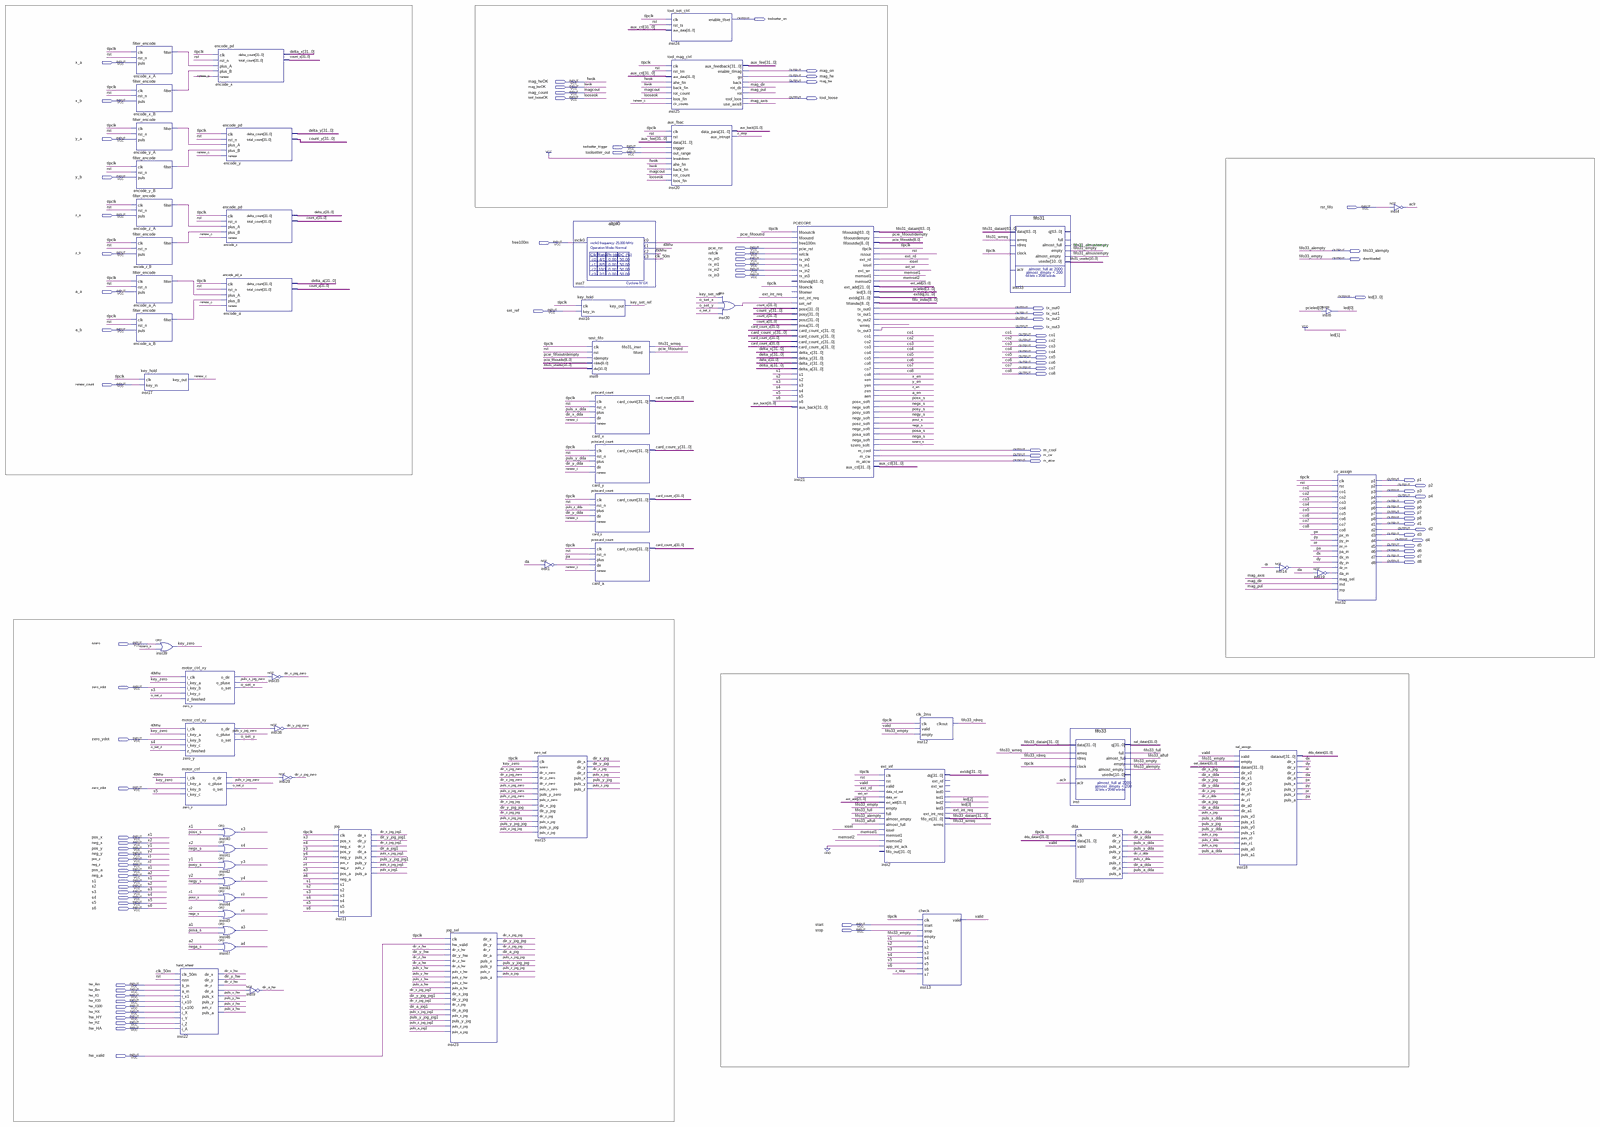
[diagram p0: schematic sheet, whole]
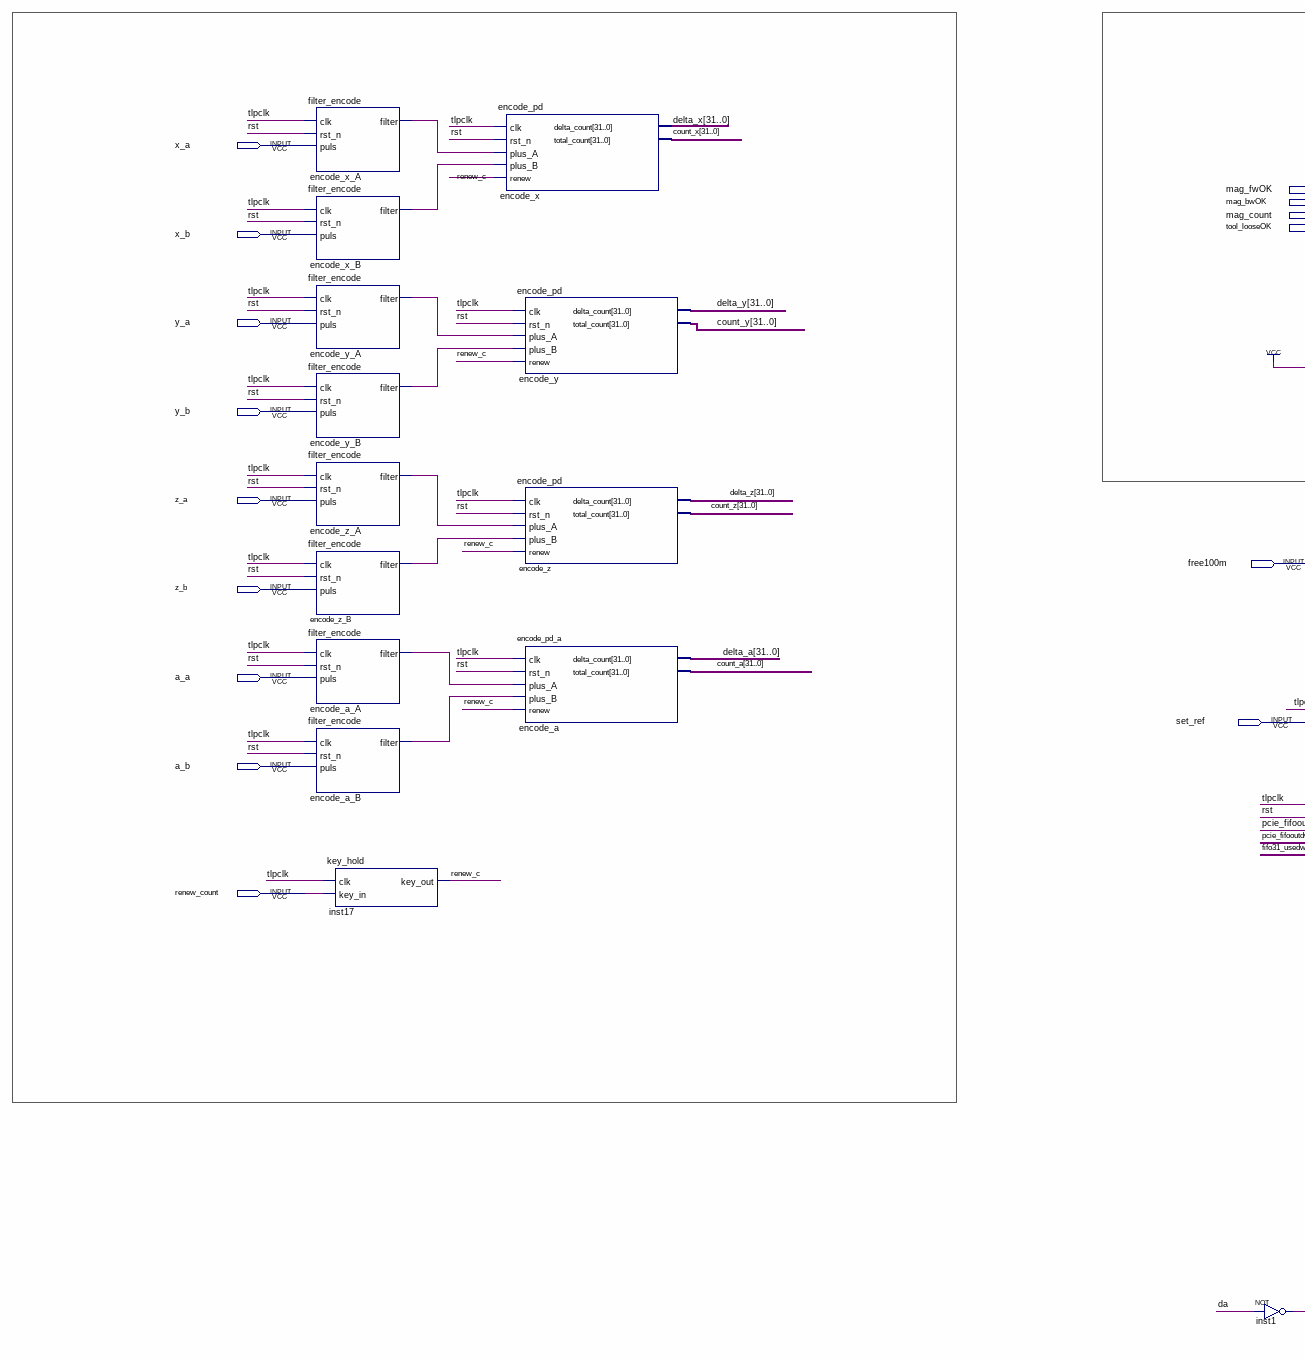
[diagram p1: schematic sheet, upper left part]
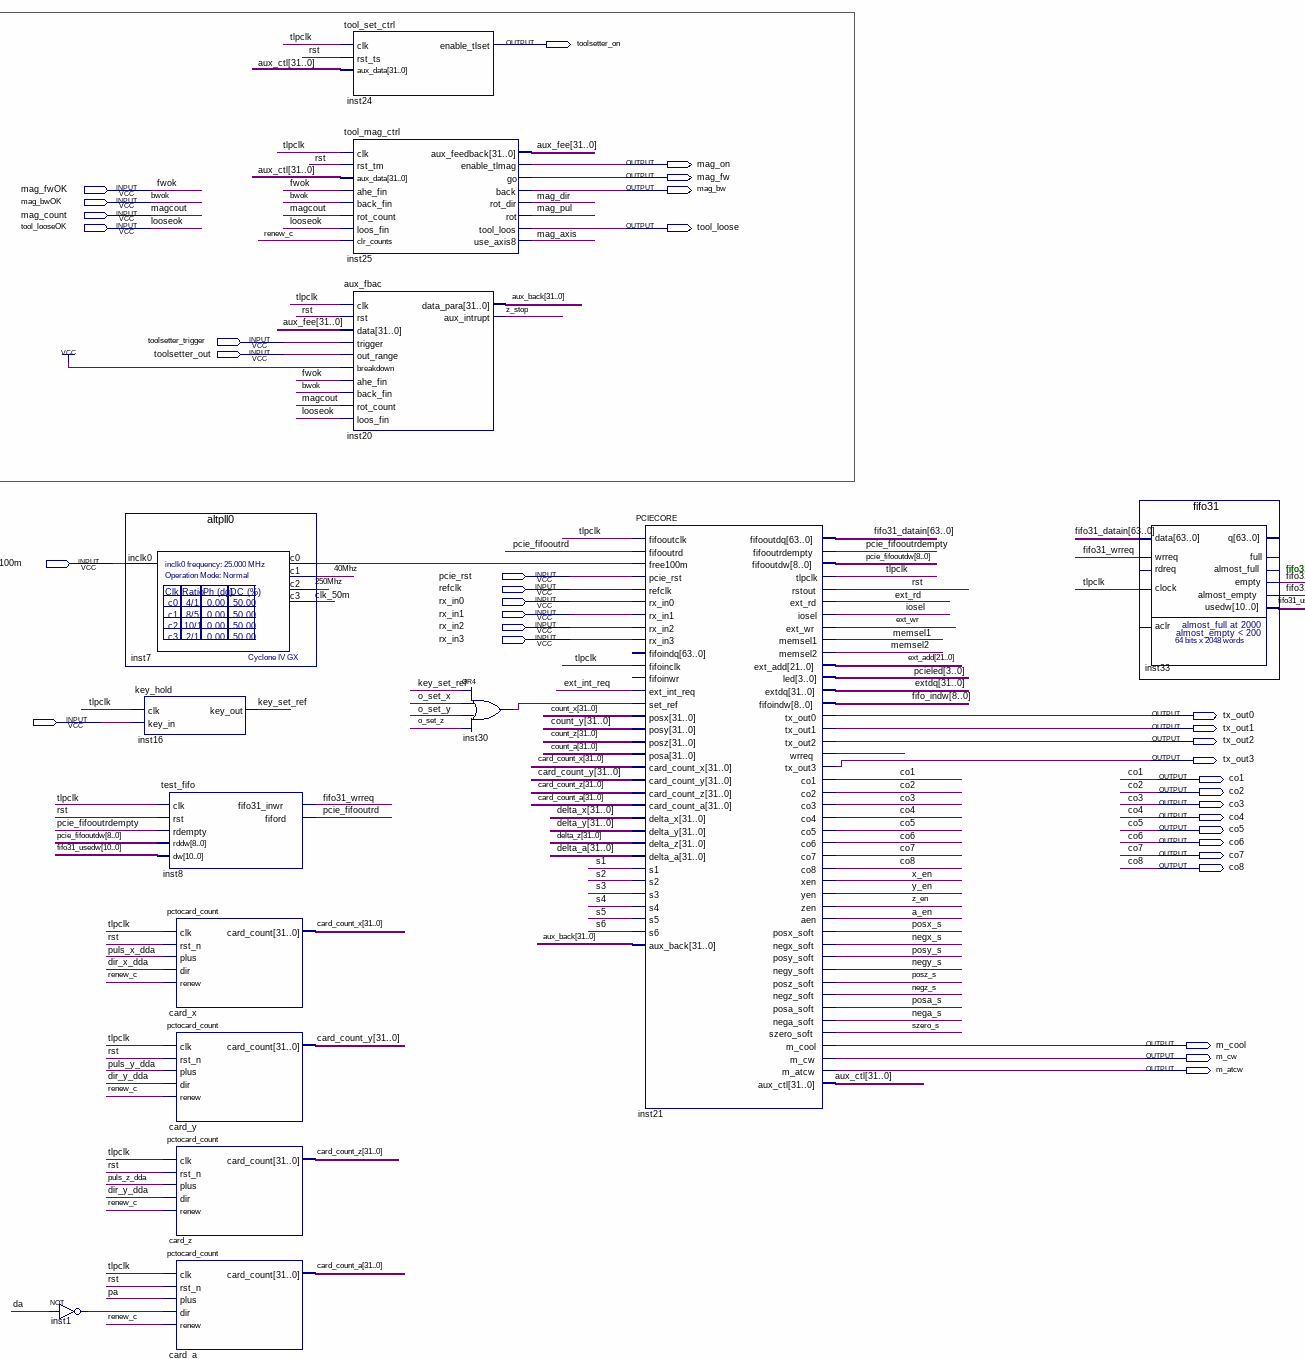
[diagram p2: schematic sheet, upper centre part]
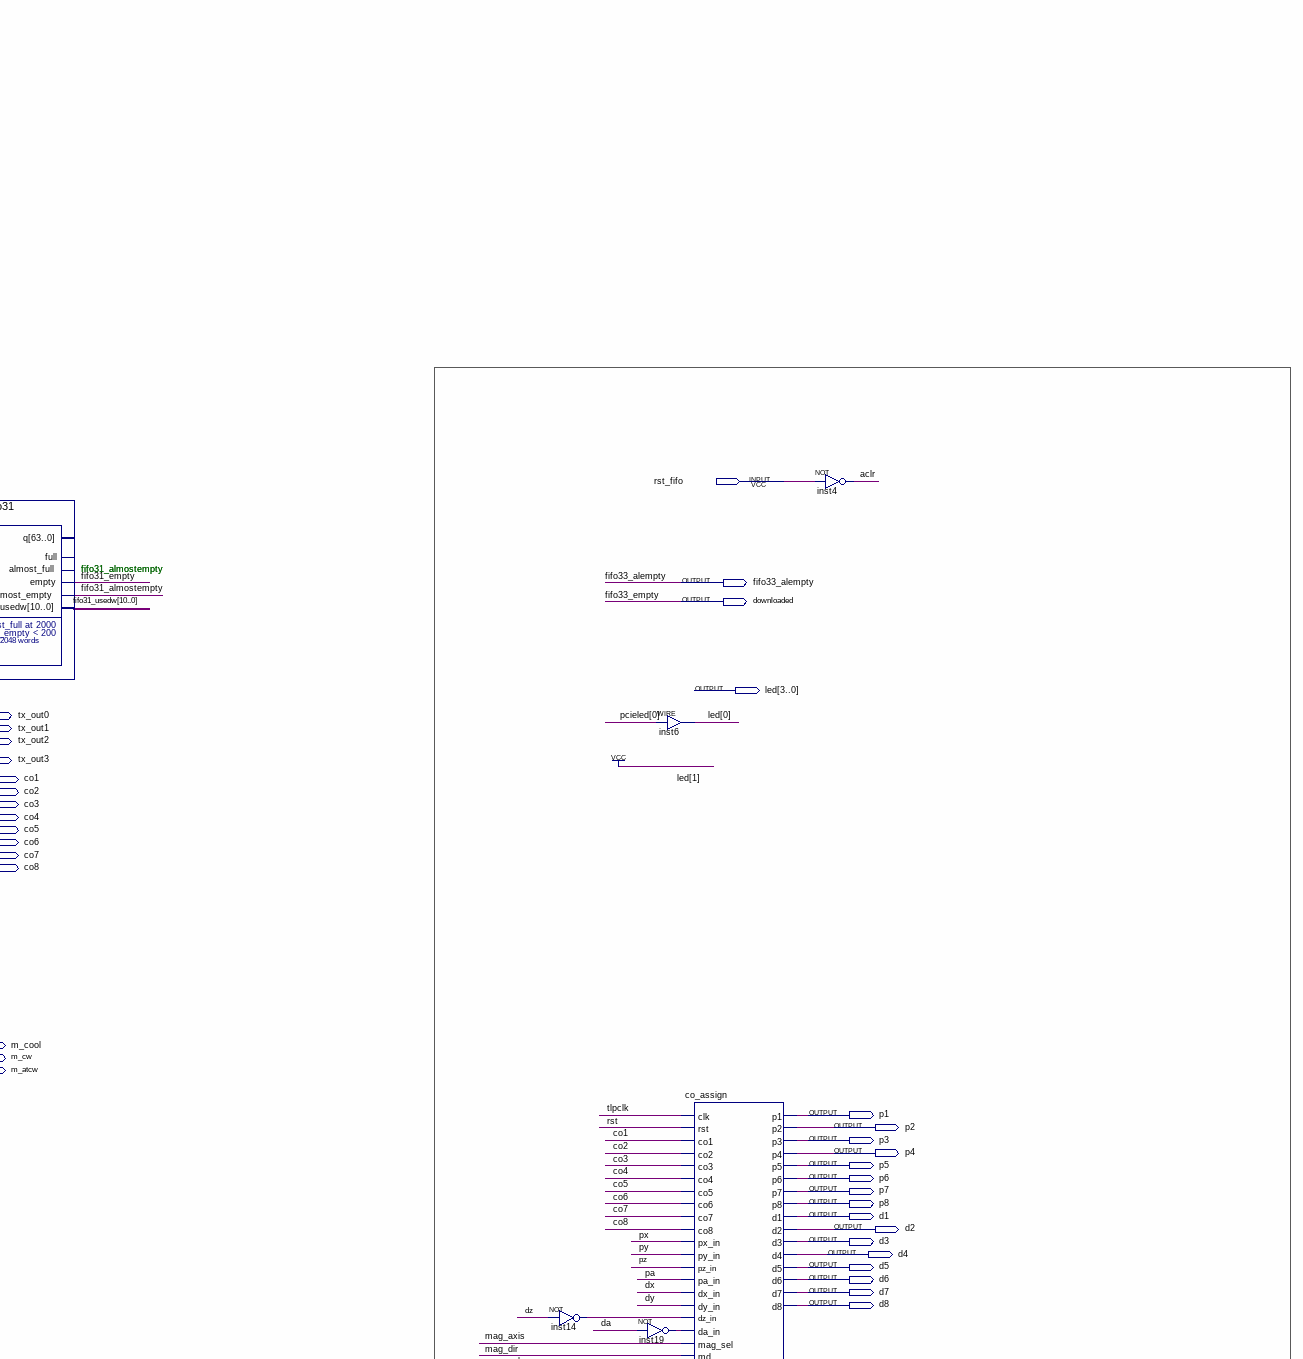
[diagram p3: schematic sheet, upper right part]
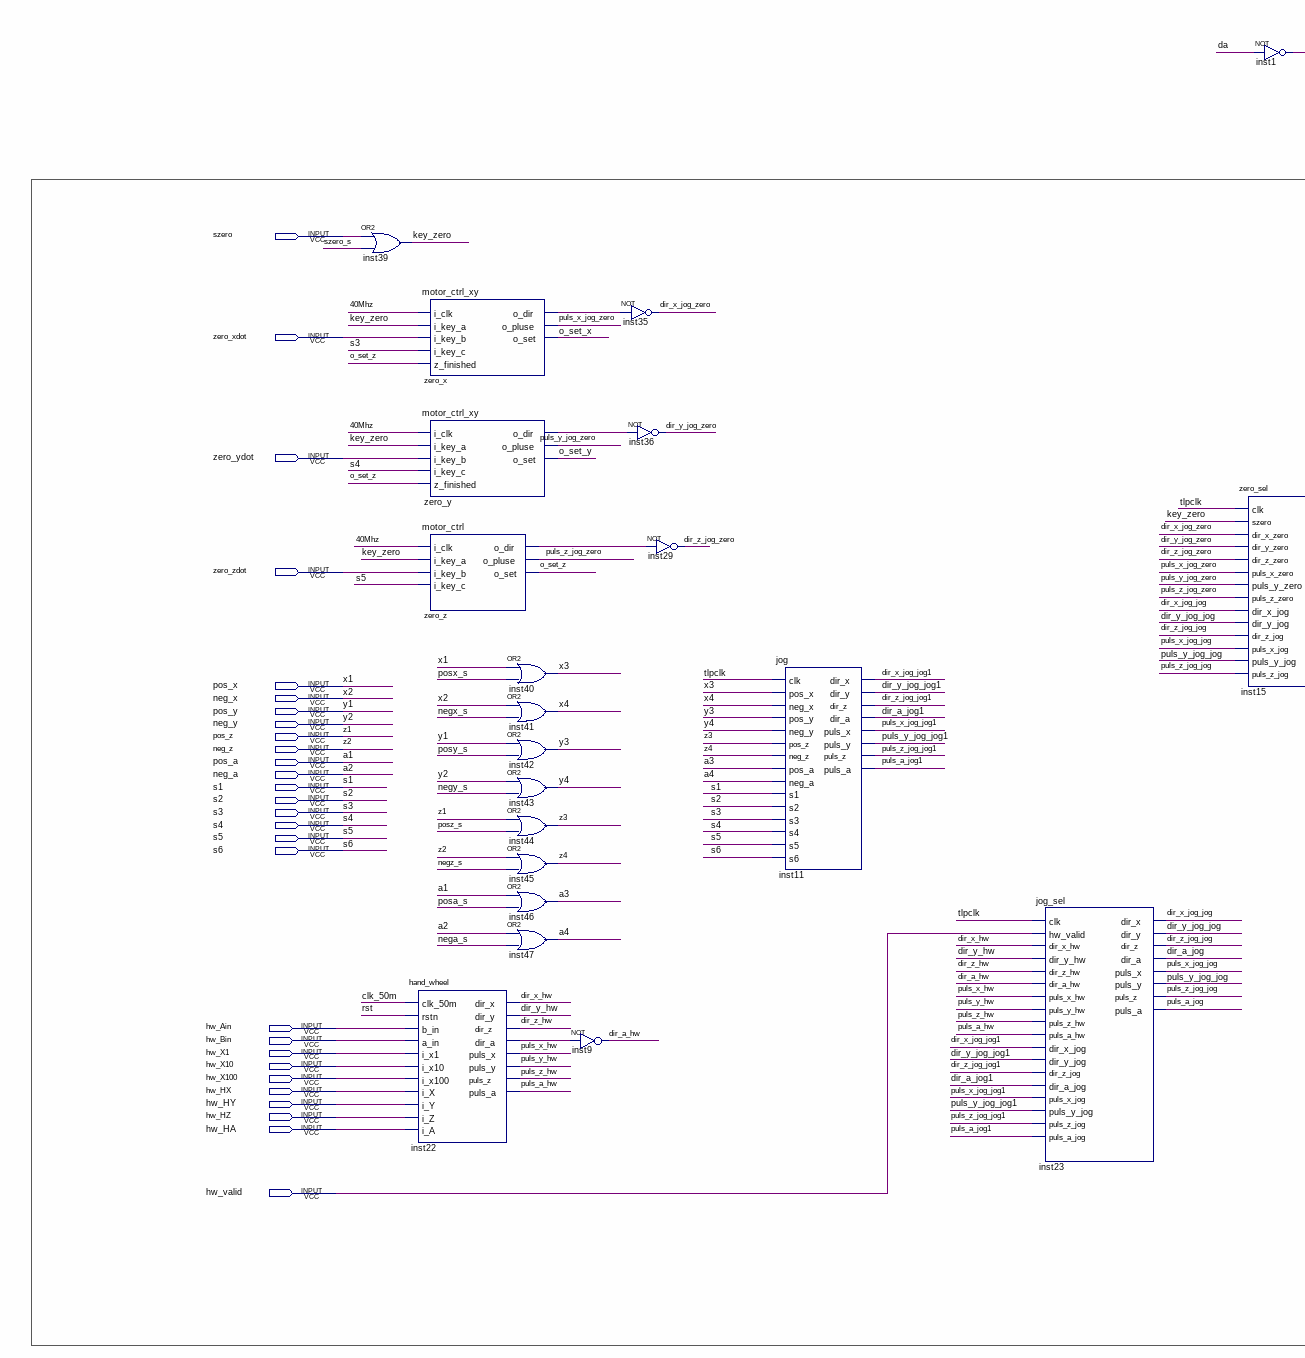
[diagram p4: schematic sheet, lower left part]
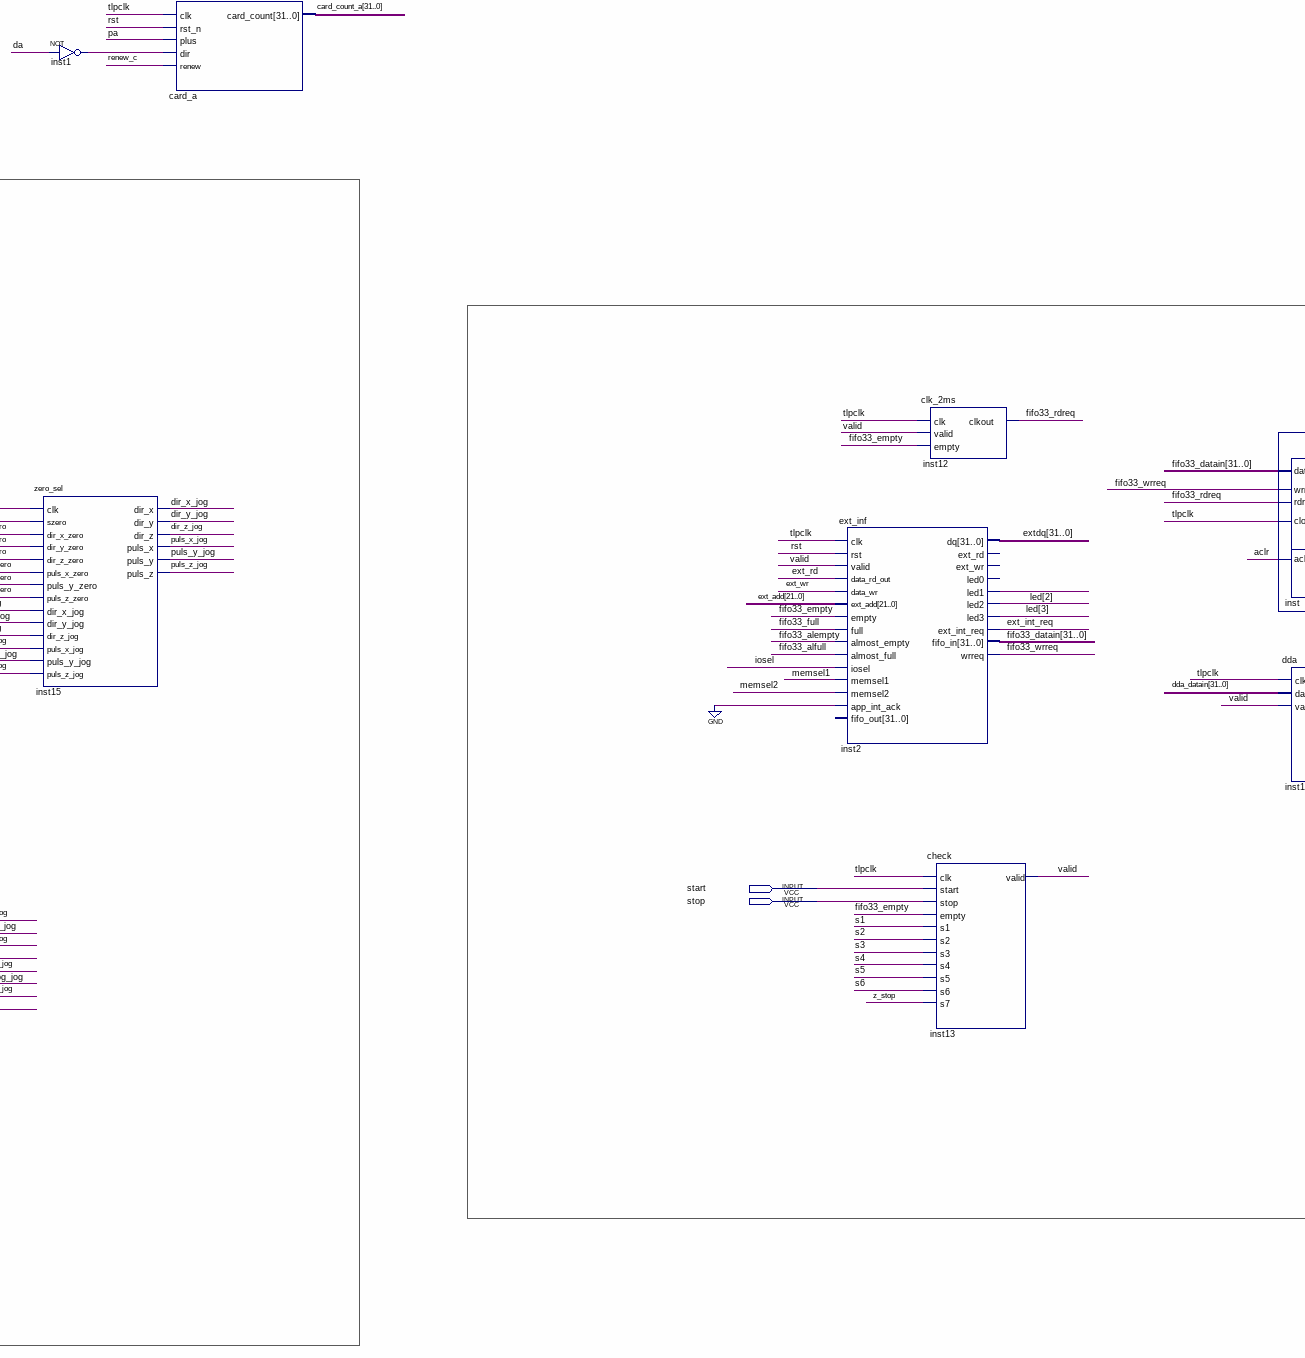
[diagram p5: schematic sheet, lower centre part]
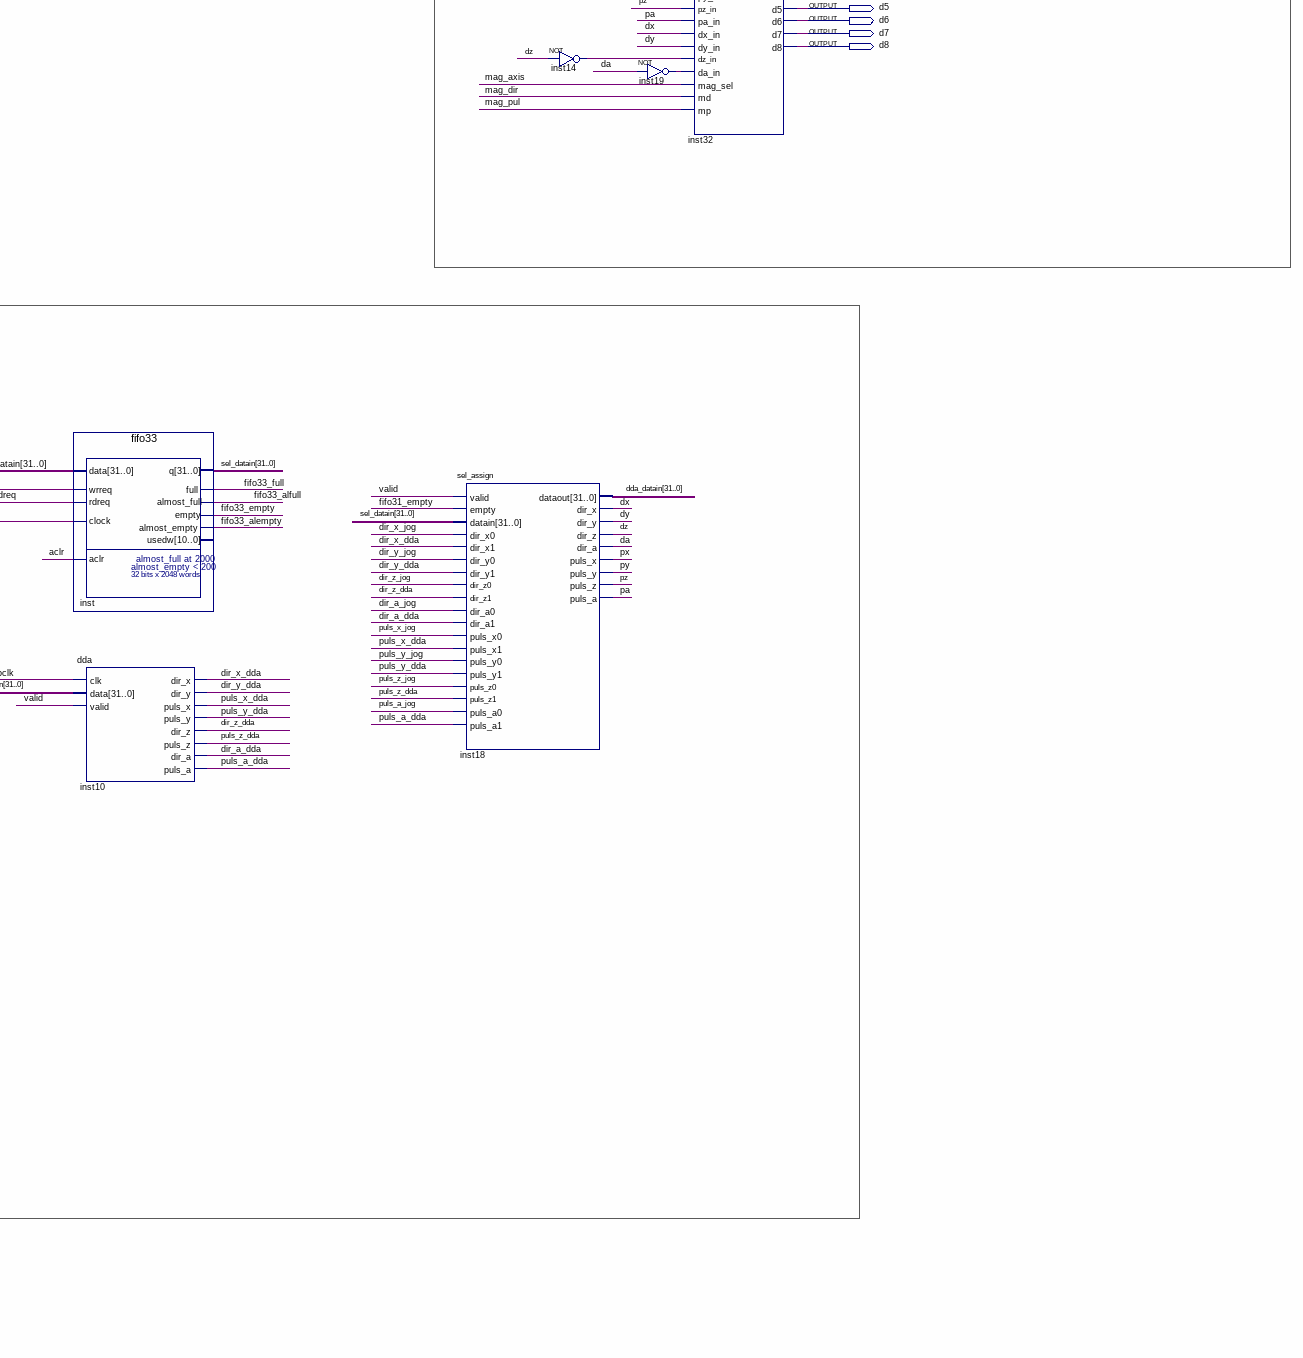
[diagram p6: schematic sheet, lower right part]
// Quartus schematic CNC_CARD.bdf as structural Verilog: 58 symbols, 93 pins
module CNC_CARD (
  input  x_a,
  input  mag_fwOK,
  input  mag_bwOK,
  input  mag_count,
  input  tool_looseOK,
  input  x_b,
  input  y_a,
  input  toolsetter_trigger,
  input  toolsetter_out,
  input  y_b,
  input  rst_fifo,
  input  z_a,
  input  free100m,
  input  pcie_rst,
  input  z_b,
  input  refclk,
  input  rx_in0,
  input  rx_in1,
  input  rx_in2,
  input  rx_in3,
  input  a_a,
  input  set_ref,
  input  a_b,
  input  renew_count,
  input  szero,
  input  zero_xdot,
  input  zero_ydot,
  input  zero_zdot,
  input  pos_x,
  input  neg_x,
  input  pos_y,
  input  neg_y,
  input  pos_z,
  input  neg_z,
  input  pos_a,
  input  neg_a,
  input  s1,
  input  s2,
  input  s3,
  input  s4,
  input  s5,
  input  s6,
  input  start,
  input  stop,
  input  hw_Ain,
  input  hw_Bin,
  input  hw_X1,
  input  hw_X10,
  input  hw_X100,
  input  hw_HX,
  input  hw_HY,
  input  hw_HZ,
  input  hw_HA,
  input  hw_valid,
  output toolsetter_on,
  output mag_on,
  output mag_fw,
  output mag_bw,
  output tool_loose,
  output fifo33_alempty,
  output downloaded,
  output [3:0] led,
  output tx_out0,
  output tx_out1,
  output tx_out2,
  output tx_out3,
  output co1,
  output co2,
  output co3,
  output co4,
  output co5,
  output co6,
  output co7,
  output co8,
  output m_cool,
  output m_cw,
  output m_atcw,
  output p1,
  output p2,
  output p3,
  output p4,
  output p5,
  output p6,
  output p7,
  output p8,
  output d1,
  output d2,
  output d3,
  output d4,
  output d5,
  output d6,
  output d7,
  output d8
);

  wire \40Mhz , \250Mhz , a3, a4, a_en, aclr, clk_50m, da, dir_a_dda, dir_a_hw, dir_a_jog, dir_a_jog1,
       dir_x_dda, dir_x_hw, dir_x_jog, dir_x_jog_jog, dir_x_jog_jog1, dir_x_jog_zero, dir_y_dda, dir_y_hw,
       dir_y_jog, dir_y_jog_jog, dir_y_jog_jog1, dir_y_jog_zero, dir_z_dda, dir_z_hw, dir_z_jog,
       dir_z_jog_jog, dir_z_jog_jog1, dir_z_jog_zero, dx, dy, dz, encode_a_A_filter, encode_a_B_filter,
       encode_x_A_filter, encode_x_B_filter, encode_y_A_filter, encode_y_B_filter, encode_z_A_filter,
       encode_z_B_filter, ext_int_req, ext_rd, ext_wr, fifo31_almostempty, fifo31_empty, fifo31_wrreq,
       fifo33_alfull, fifo33_full, fifo33_rdreq, fifo33_wrreq, inst1_out, inst2_led1, inst7_c0, inst14_out,
       inst19_out, inst21_wrreq, inst22_dir_a, inst30_out, iosel, key_set_ref, key_zero, mag_axis, mag_dir,
       mag_pul, memsel1, memsel2, nega_s, negx_s, negy_s, negz_s, o_set_x, o_set_y, o_set_z, pa,
       pcie_fifooutrd, pcie_fifooutrdempty, posa_s, posx_s, posy_s, posz_s, puls_a_dda, puls_a_hw,
       puls_a_jog, puls_a_jog1, puls_x_dda, puls_x_hw, puls_x_jog, puls_x_jog_jog, puls_x_jog_jog1,
       puls_x_jog_zero, puls_y_dda, puls_y_hw, puls_y_jog, puls_y_jog_jog, puls_y_jog_jog1, puls_y_jog_zero,
       puls_z_dda, puls_z_hw, puls_z_jog, puls_z_jog_jog, puls_z_jog_jog1, puls_z_jog_zero, px, py, pz,
       renew_c, rst, szero_s, tlpclk, valid, x3, x4, x_en, y3, y4, y_en, z3, z4, z_en, z_stop, zero_x_o_dir,
       zero_y_o_dir, zero_z_o_dir;
  wire [3:0] pcieled;
  wire [8:0] fifo_indw, pcie_fifooutdw;
  wire [10:0] fifo31_usedw;
  wire [21:0] ext_add;
  wire [31:0] aux_back, aux_ctl, aux_fee, card_count_a, card_count_x, card_count_y, card_count_z, count_a,
       count_x, count_y, count_z, dda_datain, delta_a, delta_x, delta_y, delta_z, extdq, fifo33_datain,
       sel_datain;
  wire [63:0] fifo31_datain;

  filter_encode encode_x_A (.clk(tlpclk), .rst_n(rst), .puls(x_a), .filter(encode_x_A_filter));
  filter_encode encode_x_B (.clk(tlpclk), .rst_n(rst), .puls(x_b), .filter(encode_x_B_filter));
  filter_encode encode_y_A (.clk(tlpclk), .rst_n(rst), .puls(y_a), .filter(encode_y_A_filter));
  filter_encode encode_y_B (.clk(tlpclk), .rst_n(rst), .puls(y_b), .filter(encode_y_B_filter));
  filter_encode encode_z_A (.clk(tlpclk), .rst_n(rst), .puls(z_a), .filter(encode_z_A_filter));
  filter_encode encode_z_B (.clk(tlpclk), .rst_n(rst), .puls(z_b), .filter(encode_z_B_filter));
  filter_encode encode_a_A (.clk(tlpclk), .rst_n(rst), .puls(a_a), .filter(encode_a_A_filter));
  filter_encode encode_a_B (.clk(tlpclk), .rst_n(rst), .puls(a_b), .filter(encode_a_B_filter));
  key_hold inst17 (.clk(tlpclk), .key_in(renew_count), .key_out(renew_c));
  or inst39 (key_zero, szero, szero_s);
  motor_ctrl_xy zero_x (
    .i_clk(\40Mhz ), .i_key_a(key_zero), .i_key_b(zero_xdot), .i_key_c(s3), .z_finished(o_set_z),
    .o_dir(zero_x_o_dir), .o_pluse(puls_x_jog_zero), .o_set(o_set_x));
  motor_ctrl_xy zero_y (
    .i_clk(\40Mhz ), .i_key_a(key_zero), .i_key_b(zero_ydot), .i_key_c(s4), .z_finished(o_set_z),
    .o_dir(zero_y_o_dir), .o_pluse(puls_y_jog_zero), .o_set(o_set_y));
  motor_ctrl zero_z (
    .i_clk(\40Mhz ), .i_key_a(key_zero), .i_key_b(zero_zdot), .i_key_c(s5), .o_dir(zero_z_o_dir),
    .o_pluse(puls_z_jog_zero), .o_set(o_set_z));
  hand_wheel inst22 (
    .clk_50m(clk_50m), .rstn(rst), .b_in(hw_Ain), .a_in(hw_Bin), .i_x1(hw_X1), .i_x10(hw_X10),
    .i_x100(hw_X100), .i_X(hw_HX), .i_Y(hw_HY), .i_Z(hw_HZ), .i_A(hw_HA), .dir_x(dir_x_hw), .dir_y(dir_y_hw),
    .dir_z(dir_z_hw), .dir_a(inst22_dir_a), .puls_x(puls_x_hw), .puls_y(puls_y_hw), .puls_z(puls_z_hw),
    .puls_a(puls_a_hw));
  encode_pd encode_x (
    .clk(tlpclk), .rst_n(rst), .plus_A(encode_x_A_filter), .plus_B(encode_x_B_filter), .renew(renew_c),
    .delta_count(delta_x), .total_count(count_x));
  encode_pd encode_y (
    .clk(tlpclk), .rst_n(rst), .plus_A(encode_y_A_filter), .plus_B(encode_y_B_filter), .renew(renew_c),
    .delta_count(delta_y), .total_count(count_y));
  encode_pd encode_z (
    .clk(tlpclk), .rst_n(rst), .plus_A(encode_z_A_filter), .plus_B(encode_z_B_filter), .renew(renew_c),
    .delta_count(delta_z), .total_count(count_z));
  encode_pd_a encode_a (
    .clk(tlpclk), .rst_n(rst), .plus_A(encode_a_A_filter), .plus_B(encode_a_B_filter), .renew(renew_c),
    .delta_count(delta_a), .total_count(count_a));
  or inst40 (x3, pos_x, posx_s);
  or inst41 (x4, neg_x, negx_s);
  or inst42 (y3, pos_y, posy_s);
  or inst43 (y4, neg_y, negy_s);
  or inst44 (z3, pos_z, posz_s);
  or inst45 (z4, neg_z, negz_s);
  or inst46 (a3, pos_a, posa_s);
  or inst47 (a4, neg_a, nega_s);
  not inst9 (dir_a_hw, inst22_dir_a);
  not inst35 (dir_x_jog_zero, zero_x_o_dir);
  not inst36 (dir_y_jog_zero, zero_y_o_dir);
  not inst29 (dir_z_jog_zero, zero_z_o_dir);
  jog inst11 (
    .clk(tlpclk), .pos_x(x3), .neg_x(x4), .pos_y(y3), .neg_y(y4), .pos_z(z3), .neg_z(z4), .pos_a(a3),
    .neg_a(a4), .s1(s1), .s2(s2), .s3(s3), .s4(s4), .s5(s5), .s6(s6), .dir_x(dir_x_jog_jog1),
    .dir_y(dir_y_jog_jog1), .dir_z(dir_z_jog_jog1), .dir_a(dir_a_jog1), .puls_x(puls_x_jog_jog1),
    .puls_y(puls_y_jog_jog1), .puls_z(puls_z_jog_jog1), .puls_a(puls_a_jog1));
  jog_sel inst23 (
    .clk(tlpclk), .hw_valid(hw_valid), .dir_x_hw(dir_x_hw), .dir_y_hw(dir_y_hw), .dir_z_hw(dir_z_hw),
    .dir_a_hw(dir_a_hw), .puls_x_hw(puls_x_hw), .puls_y_hw(puls_y_hw), .puls_z_hw(puls_z_hw),
    .puls_a_hw(puls_a_hw), .dir_x_jog(dir_x_jog_jog1), .dir_y_jog(dir_y_jog_jog1),
    .dir_z_jog(dir_z_jog_jog1), .dir_a_jog(dir_a_jog1), .puls_x_jog(puls_x_jog_jog1),
    .puls_y_jog(puls_y_jog_jog1), .puls_z_jog(puls_z_jog_jog1), .puls_a_jog(puls_a_jog1),
    .dir_x(dir_x_jog_jog), .dir_y(dir_y_jog_jog), .dir_z(dir_z_jog_jog), .dir_a(dir_a_jog),
    .puls_x(puls_x_jog_jog), .puls_y(puls_y_jog_jog), .puls_z(puls_z_jog_jog), .puls_a(puls_a_jog));
  not inst1 (inst1_out, da);
  zero_sel inst15 (
    .clk(tlpclk), .szero(key_zero), .dir_x_zero(dir_x_jog_zero), .dir_y_zero(dir_y_jog_zero),
    .dir_z_zero(dir_z_jog_zero), .puls_x_zero(puls_x_jog_zero), .puls_y_zero(puls_y_jog_zero),
    .puls_z_zero(puls_z_jog_zero), .dir_x_jog(dir_x_jog_jog), .dir_y_jog(dir_y_jog_jog),
    .dir_z_jog(dir_z_jog_jog), .puls_x_jog(puls_x_jog_jog), .puls_y_jog(puls_y_jog_jog),
    .puls_z_jog(puls_z_jog_jog), .dir_x(dir_x_jog), .dir_y(dir_y_jog), .dir_z(dir_z_jog),
    .puls_x(puls_x_jog), .puls_y(puls_y_jog), .puls_z(puls_z_jog));
  altpll0 inst7 (.inclk0(free100m), .c0(inst7_c0), .c1(\40Mhz ), .c2(\250Mhz ), .c3(clk_50m));
  key_hold inst16 (.clk(tlpclk), .key_in(set_ref), .key_out(key_set_ref));
  test_fifo inst8 (
    .clk(tlpclk), .rst(rst), .rdempty(pcie_fifooutrdempty), .rddw(pcie_fifooutdw), .dw(fifo31_usedw),
    .fifo31_inwr(fifo31_wrreq), .fiford(pcie_fifooutrd));
  pctocard_count card_x (
    .clk(tlpclk), .rst_n(rst), .plus(puls_x_dda), .dir(dir_x_dda), .renew(renew_c), .card_count(card_count_x));
  pctocard_count card_y (
    .clk(tlpclk), .rst_n(rst), .plus(puls_y_dda), .dir(dir_y_dda), .renew(renew_c), .card_count(card_count_y));
  pctocard_count card_z (
    .clk(tlpclk), .rst_n(rst), .plus(puls_z_dda), .dir(dir_y_dda), .renew(renew_c), .card_count(card_count_z));
  pctocard_count card_a (
    .clk(tlpclk), .rst_n(rst), .plus(pa), .dir(inst1_out), .renew(renew_c), .card_count(card_count_a));
  tool_set_ctrl inst24 (.clk(tlpclk), .rst_ts(rst), .aux_data(aux_ctl), .enable_tlset(toolsetter_on));
  tool_mag_ctrl inst25 (
    .clk(tlpclk), .rst_tm(rst), .aux_data(aux_ctl), .ahe_fin(mag_fwOK), .back_fin(mag_bwOK),
    .rot_count(mag_count), .loos_fin(tool_looseOK), .clr_counts(renew_c), .aux_feedback(aux_fee),
    .enable_tlmag(mag_on), .go(mag_fw), .back(mag_bw), .rot_dir(mag_dir), .rot(mag_pul),
    .tool_loos(tool_loose), .use_axis8(mag_axis));
  aux_fbac inst20 (
    .clk(tlpclk), .rst(rst), .data(aux_fee), .trigger(toolsetter_trigger), .out_range(toolsetter_out),
    .breakdown(1'b1), .ahe_fin(mag_fwOK), .back_fin(mag_bwOK), .rot_count(mag_count),
    .loos_fin(tool_looseOK), .data_para(aux_back), .aux_intrupt(z_stop));
  or inst30 (inst30_out, key_set_ref, o_set_x, o_set_y, o_set_z);
  PCIECORE inst21 (
    .fifooutclk(tlpclk), .fifooutrd(pcie_fifooutrd), .free100m(inst7_c0), .pcie_rst(pcie_rst),
    .refclk(refclk), .rx_in0(rx_in0), .rx_in1(rx_in1), .rx_in2(rx_in2), .rx_in3(rx_in3), .fifoinclk(tlpclk),
    .ext_int_req(ext_int_req), .set_ref(inst30_out), .posx(count_x), .posy(count_y), .posz(count_z),
    .posa(count_a), .card_count_x(card_count_x), .card_count_y(card_count_y), .card_count_z(card_count_z),
    .card_count_a(card_count_a), .delta_x(delta_x), .delta_y(delta_y), .delta_z(delta_z), .delta_a(delta_a),
    .s1(s1), .s2(s2), .s3(s3), .s4(s4), .s5(s5), .s6(s6), .aux_back(aux_back), .fifooutdq(fifo31_datain),
    .fifooutrdempty(pcie_fifooutrdempty), .fifooutdw(pcie_fifooutdw), .tlpclk(tlpclk), .rstout(rst),
    .ext_rd(ext_rd), .iosel(iosel), .ext_wr(ext_wr), .memsel1(memsel1), .memsel2(memsel2), .ext_add(ext_add),
    .led(pcieled), .fifoindw(fifo_indw), .tx_out0(tx_out0), .tx_out1(tx_out1), .tx_out2(tx_out2),
    .wrreq(inst21_wrreq), .tx_out3(tx_out3), .co1(co1), .co2(co2), .co3(co3), .co4(co4), .co5(co5),
    .co6(co6), .co7(co7), .co8(co8), .xen(x_en), .yen(y_en), .zen(z_en), .aen(a_en), .posx_soft(posx_s),
    .negx_soft(negx_s), .posy_soft(posy_s), .negy_soft(negy_s), .posz_soft(posz_s), .negz_soft(negz_s),
    .posa_soft(posa_s), .nega_soft(nega_s), .szero_soft(szero_s), .m_cool(m_cool), .m_cw(m_cw),
    .m_atcw(m_atcw), .aux_ctl(aux_ctl), .extdq(extdq));  // open: fifoindq, fifoinwr
  ext_inf inst2 (
    .clk(tlpclk), .rst(rst), .valid(valid), .data_rd_out(ext_rd), .data_wr(ext_wr), .ext_add(ext_add),
    .empty(downloaded), .full(fifo33_full), .almost_empty(fifo33_alempty), .almost_full(fifo33_alfull),
    .iosel(iosel), .memsel1(memsel1), .memsel2(memsel2), .app_int_ack(1'b0), .led1(inst2_led1),
    .led2(led[2]), .led3(led[3]), .ext_int_req(ext_int_req), .fifo_in(fifo33_datain), .wrreq(fifo33_wrreq),
    .dq(extdq));  // open: fifo_out, ext_rd, ext_wr, led0
  clk_2ms inst12 (.clk(tlpclk), .valid(valid), .empty(downloaded), .clkout(fifo33_rdreq));
  check inst13 (
    .clk(tlpclk), .start(start), .stop(stop), .empty(downloaded), .s1(s1), .s2(s2), .s3(s3), .s4(s4),
    .s5(s5), .s6(s6), .s7(z_stop), .valid(valid));
  fifo31 inst33 (
    .data(fifo31_datain), .wrreq(fifo31_wrreq), .clock(tlpclk), .empty(fifo31_empty),
    .almost_empty(fifo31_almostempty), .usedw(fifo31_usedw));  // open: rdreq, aclr, q, full, almost_full
  fifo33 inst (
    .data(fifo33_datain), .wrreq(fifo33_wrreq), .rdreq(fifo33_rdreq), .clock(tlpclk), .aclr(aclr),
    .q(sel_datain), .full(fifo33_full), .almost_full(fifo33_alfull), .empty(downloaded),
    .almost_empty(fifo33_alempty));  // open: usedw
  dda inst10 (
    .clk(tlpclk), .data(dda_datain), .valid(valid), .dir_x(dir_x_dda), .dir_y(dir_y_dda),
    .puls_x(puls_x_dda), .puls_y(puls_y_dda), .dir_z(dir_z_dda), .puls_z(puls_z_dda), .dir_a(dir_a_dda),
    .puls_a(puls_a_dda));
  sel_assign inst18 (
    .valid(valid), .empty(fifo31_empty), .datain(sel_datain), .dir_x0(dir_x_jog), .dir_x1(dir_x_dda),
    .dir_y0(dir_y_jog), .dir_y1(dir_y_dda), .dir_z0(dir_z_jog), .dir_z1(dir_z_dda), .dir_a0(dir_a_jog),
    .dir_a1(dir_a_dda), .puls_x0(puls_x_jog), .puls_x1(puls_x_dda), .puls_y0(puls_y_jog),
    .puls_y1(puls_y_dda), .puls_z0(puls_z_jog), .puls_z1(puls_z_dda), .puls_a0(puls_a_jog),
    .puls_a1(puls_a_dda), .dataout(dda_datain), .dir_x(dx), .dir_y(dy), .dir_z(dz), .dir_a(da), .puls_x(px),
    .puls_y(py), .puls_z(pz), .puls_a(pa));
  not inst14 (inst14_out, dz);
  assign led[0] = pcieled[0];  // WIRE inst6
  not inst19 (inst19_out, da);
  co_assign inst32 (
    .clk(tlpclk), .rst(rst), .co1(co1), .co2(co2), .co3(co3), .co4(co4), .co5(co5), .co6(co6), .co7(co7),
    .co8(co8), .px_in(px), .py_in(py), .pz_in(pz), .pa_in(pa), .dx_in(dx), .dy_in(dy), .dz_in(inst14_out),
    .da_in(inst19_out), .mag_sel(mag_axis), .md(mag_dir), .mp(mag_pul), .p1(p1), .p2(p2), .p3(p3), .p4(p4),
    .p5(p5), .p6(p6), .p7(p7), .p8(p8), .d1(d1), .d2(d2), .d3(d3), .d4(d4), .d5(d5), .d6(d6), .d7(d7), .d8(d8));
  not inst4 (aclr, rst_fifo);

  assign led[1] = 1'b1;

  // Other names for the same wires on the sheet: a1 = pos_a; a2 = neg_a; bwok = mag_bwOK; fifo33_empty = downloaded;
  //   fwok = mag_fwOK; looseok = tool_looseOK; magcout = mag_count; x1 = pos_x; x2 = neg_x; y1 = pos_y; y2 = neg_y;
  //   z1 = pos_z; z2 = neg_z

  // Notes on the sheet:
  //   fifo31_almostempty
  //   fifo31_almostempty
endmodule
